# Altium schematic sheet ChargersControl.SchDoc
size A0
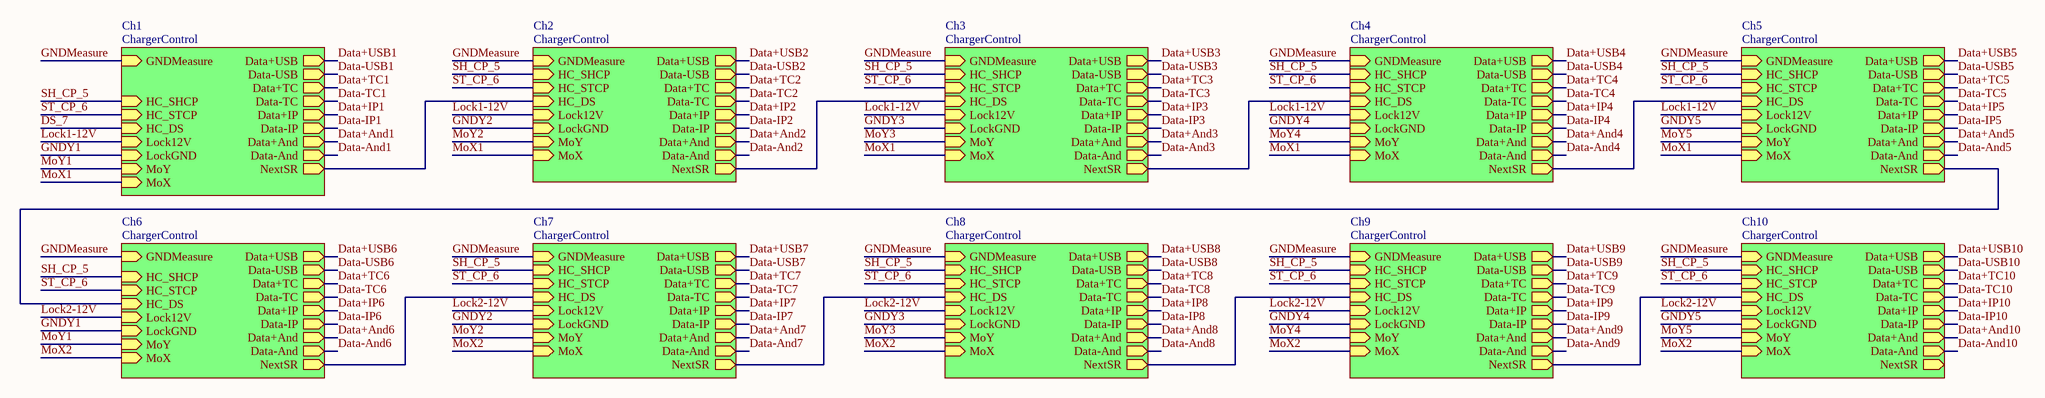
[diagram p0: ChargersControl.SchDoc]

## Sub-sheets
Ch1 = ChargerControl: GNDMeasure (in), HC_SHCP (in), HC_STCP (in), HC_DS (in), Data+USB (out), Data-USB (out), Data-TC (out), Data+TC (out), Data-And (out), Data+IP (out), Data-IP (out), Data+And (out), NextSR (out), Lock12V (in), LockGND (in), MoY (in), MoX (in)
Ch2 = ChargerControl: GNDMeasure (in), MoY (in), MoX (in), HC_SHCP (in), HC_STCP (in), HC_DS (in), Data+USB (out), Data-USB (out), Data-TC (out), Data+TC (out), Data-And (out), Data+IP (out), Data-IP (out), Data+And (out), NextSR (out), Lock12V (in), LockGND (in)
Ch3 = ChargerControl: GNDMeasure (in), MoY (in), MoX (in), HC_SHCP (in), HC_STCP (in), HC_DS (in), Data+USB (out), Data-USB (out), Data-TC (out), Data+TC (out), Data-And (out), Data+IP (out), Data-IP (out), Data+And (out), NextSR (out), Lock12V (in), LockGND (in)
Ch4 = ChargerControl: GNDMeasure (in), MoY (in), MoX (in), HC_SHCP (in), HC_STCP (in), HC_DS (in), Data+USB (out), Data-USB (out), Data-TC (out), Data+TC (out), Data-And (out), Data+IP (out), Data-IP (out), Data+And (out), NextSR (out), Lock12V (in), LockGND (in)
Ch5 = ChargerControl: GNDMeasure (in), MoY (in), MoX (in), HC_SHCP (in), HC_STCP (in), HC_DS (in), Data+USB (out), Data-USB (out), Data-TC (out), Data+TC (out), Data-And (out), Data+IP (out), Data-IP (out), Data+And (out), NextSR (out), Lock12V (in), LockGND (in)
Ch6 = ChargerControl: GNDMeasure (in), Data+USB (out), Data-USB (out), Data-TC (out), Data+TC (out), Data-And (out), Data+IP (out), Data-IP (out), Data+And (out), NextSR (out), HC_SHCP (in), HC_STCP (in), HC_DS (in), Lock12V (in), LockGND (in), MoY (in), MoX (in)
Ch7 = ChargerControl: GNDMeasure (in), MoY (in), MoX (in), HC_SHCP (in), HC_STCP (in), HC_DS (in), Data+USB (out), Data-USB (out), Data-TC (out), Data+TC (out), Data-And (out), Data+IP (out), Data-IP (out), Data+And (out), NextSR (out), Lock12V (in), LockGND (in)
Ch8 = ChargerControl: GNDMeasure (in), MoY (in), MoX (in), HC_SHCP (in), HC_STCP (in), HC_DS (in), Data+USB (out), Data-USB (out), Data-TC (out), Data+TC (out), Data-And (out), Data+IP (out), Data-IP (out), Data+And (out), NextSR (out), Lock12V (in), LockGND (in)
Ch9 = ChargerControl: GNDMeasure (in), MoY (in), MoX (in), HC_SHCP (in), HC_STCP (in), HC_DS (in), Data+USB (out), Data-USB (out), Data-TC (out), Data+TC (out), Data-And (out), Data+IP (out), Data-IP (out), Data+And (out), NextSR (out), Lock12V (in), LockGND (in)
Ch10 = ChargerControl: GNDMeasure (in), MoY (in), MoX (in), HC_SHCP (in), HC_STCP (in), HC_DS (in), Data+USB (out), Data-USB (out), Data-TC (out), Data+TC (out), Data-And (out), Data+IP (out), Data-IP (out), Data+And (out), NextSR (out), Lock12V (in), LockGND (in)

## Nets
Data+And1: sheet Ch1/Data+And
Data+And2: sheet Ch2/Data+And
Data+And3: sheet Ch3/Data+And
Data+And4: sheet Ch4/Data+And
Data+And5: sheet Ch5/Data+And
Data+And6: sheet Ch6/Data+And
Data+And7: sheet Ch7/Data+And
Data+And8: sheet Ch8/Data+And
Data+And9: sheet Ch9/Data+And
Data+And10: sheet Ch10/Data+And
Data+IP1: sheet Ch1/Data+IP
Data+IP2: sheet Ch2/Data+IP
Data+IP3: sheet Ch3/Data+IP
Data+IP4: sheet Ch4/Data+IP
Data+IP5: sheet Ch5/Data+IP
Data+IP6: sheet Ch6/Data+IP
Data+IP7: sheet Ch7/Data+IP
Data+IP8: sheet Ch8/Data+IP
Data+IP9: sheet Ch9/Data+IP
Data+IP10: sheet Ch10/Data+IP
Data+TC1: sheet Ch1/Data+TC
Data+TC2: sheet Ch2/Data+TC
Data+TC3: sheet Ch3/Data+TC
Data+TC4: sheet Ch4/Data+TC
Data+TC5: sheet Ch5/Data+TC
Data+TC6: sheet Ch6/Data+TC
Data+TC7: sheet Ch7/Data+TC
Data+TC8: sheet Ch8/Data+TC
Data+TC9: sheet Ch9/Data+TC
Data+TC10: sheet Ch10/Data+TC
Data+USB1: sheet Ch1/Data+USB
Data+USB2: sheet Ch2/Data+USB
Data+USB3: sheet Ch3/Data+USB
Data+USB4: sheet Ch4/Data+USB
Data+USB5: sheet Ch5/Data+USB
Data+USB6: sheet Ch6/Data+USB
Data+USB7: sheet Ch7/Data+USB
Data+USB8: sheet Ch8/Data+USB
Data+USB9: sheet Ch9/Data+USB
Data+USB10: sheet Ch10/Data+USB
Data-And1: sheet Ch1/Data-And
Data-And2: sheet Ch2/Data-And
Data-And3: sheet Ch3/Data-And
Data-And4: sheet Ch4/Data-And
Data-And5: sheet Ch5/Data-And
Data-And6: sheet Ch6/Data-And
Data-And7: sheet Ch7/Data-And
Data-And8: sheet Ch8/Data-And
Data-And9: sheet Ch9/Data-And
Data-And10: sheet Ch10/Data-And
Data-IP1: sheet Ch1/Data-IP
Data-IP2: sheet Ch2/Data-IP
Data-IP3: sheet Ch3/Data-IP
Data-IP4: sheet Ch4/Data-IP
Data-IP5: sheet Ch5/Data-IP
Data-IP6: sheet Ch6/Data-IP
Data-IP7: sheet Ch7/Data-IP
Data-IP8: sheet Ch8/Data-IP
Data-IP9: sheet Ch9/Data-IP
Data-IP10: sheet Ch10/Data-IP
Data-TC1: sheet Ch1/Data-TC
Data-TC2: sheet Ch2/Data-TC
Data-TC3: sheet Ch3/Data-TC
Data-TC4: sheet Ch4/Data-TC
Data-TC5: sheet Ch5/Data-TC
Data-TC6: sheet Ch6/Data-TC
Data-TC7: sheet Ch7/Data-TC
Data-TC8: sheet Ch8/Data-TC
Data-TC9: sheet Ch9/Data-TC
Data-TC10: sheet Ch10/Data-TC
Data-USB1: sheet Ch1/Data-USB
Data-USB2: sheet Ch2/Data-USB
Data-USB3: sheet Ch3/Data-USB
Data-USB4: sheet Ch4/Data-USB
Data-USB5: sheet Ch5/Data-USB
Data-USB6: sheet Ch6/Data-USB
Data-USB7: sheet Ch7/Data-USB
Data-USB8: sheet Ch8/Data-USB
Data-USB9: sheet Ch9/Data-USB
Data-USB10: sheet Ch10/Data-USB
DS_7: sheet Ch1/HC_DS
GNDMeasure: sheet Ch1/GNDMeasure, sheet Ch2/GNDMeasure, sheet Ch3/GNDMeasure, sheet Ch4/GNDMeasure, sheet Ch5/GNDMeasure, sheet Ch6/GNDMeasure, sheet Ch7/GNDMeasure, sheet Ch8/GNDMeasure, sheet Ch9/GNDMeasure, sheet Ch10/GNDMeasure
GNDY1: sheet Ch1/LockGND, sheet Ch6/LockGND
GNDY2: sheet Ch2/LockGND, sheet Ch7/LockGND
GNDY3: sheet Ch3/LockGND, sheet Ch8/LockGND
GNDY4: sheet Ch4/LockGND, sheet Ch9/LockGND
GNDY5: sheet Ch5/LockGND, sheet Ch10/LockGND
Lock1-12V: sheet Ch1/Lock12V, sheet Ch2/Lock12V, sheet Ch3/Lock12V, sheet Ch4/Lock12V, sheet Ch5/Lock12V
Lock2-12V: sheet Ch6/Lock12V, sheet Ch7/Lock12V, sheet Ch8/Lock12V, sheet Ch9/Lock12V, sheet Ch10/Lock12V
MoX1: sheet Ch1/MoX, sheet Ch2/MoX, sheet Ch3/MoX, sheet Ch4/MoX, sheet Ch5/MoX
MoX2: sheet Ch6/MoX, sheet Ch7/MoX, sheet Ch8/MoX, sheet Ch9/MoX, sheet Ch10/MoX
MoY1: sheet Ch1/MoY, sheet Ch6/MoY
MoY2: sheet Ch2/MoY, sheet Ch7/MoY
MoY3: sheet Ch3/MoY, sheet Ch8/MoY
MoY4: sheet Ch4/MoY, sheet Ch9/MoY
MoY5: sheet Ch5/MoY, sheet Ch10/MoY
SH_CP_5: sheet Ch1/HC_SHCP, sheet Ch2/HC_SHCP, sheet Ch3/HC_SHCP, sheet Ch4/HC_SHCP, sheet Ch5/HC_SHCP, sheet Ch6/HC_SHCP, sheet Ch7/HC_SHCP, sheet Ch8/HC_SHCP, sheet Ch9/HC_SHCP, sheet Ch10/HC_SHCP
ST_CP_6: sheet Ch1/HC_STCP, sheet Ch2/HC_STCP, sheet Ch3/HC_STCP, sheet Ch4/HC_STCP, sheet Ch5/HC_STCP, sheet Ch6/HC_STCP, sheet Ch7/HC_STCP, sheet Ch8/HC_STCP, sheet Ch9/HC_STCP, sheet Ch10/HC_STCP
(unnamed): sheet Ch1/NextSR, sheet Ch2/HC_DS
(unnamed): sheet Ch2/NextSR, sheet Ch3/HC_DS
(unnamed): sheet Ch3/NextSR, sheet Ch4/HC_DS
(unnamed): sheet Ch4/NextSR, sheet Ch5/HC_DS
(unnamed): sheet Ch5/NextSR, sheet Ch6/HC_DS
(unnamed): sheet Ch6/NextSR, sheet Ch7/HC_DS
(unnamed): sheet Ch7/NextSR, sheet Ch8/HC_DS
(unnamed): sheet Ch8/NextSR, sheet Ch9/HC_DS
(unnamed): sheet Ch9/NextSR, sheet Ch10/HC_DS

## Notes on the sheet
- Title
- Size:
- Date:
- File:
- A0
- Number:
- Time:
- Revision:
- Sheet
- of